# Altium schematic sheet Sheet6.SchDoc
size B
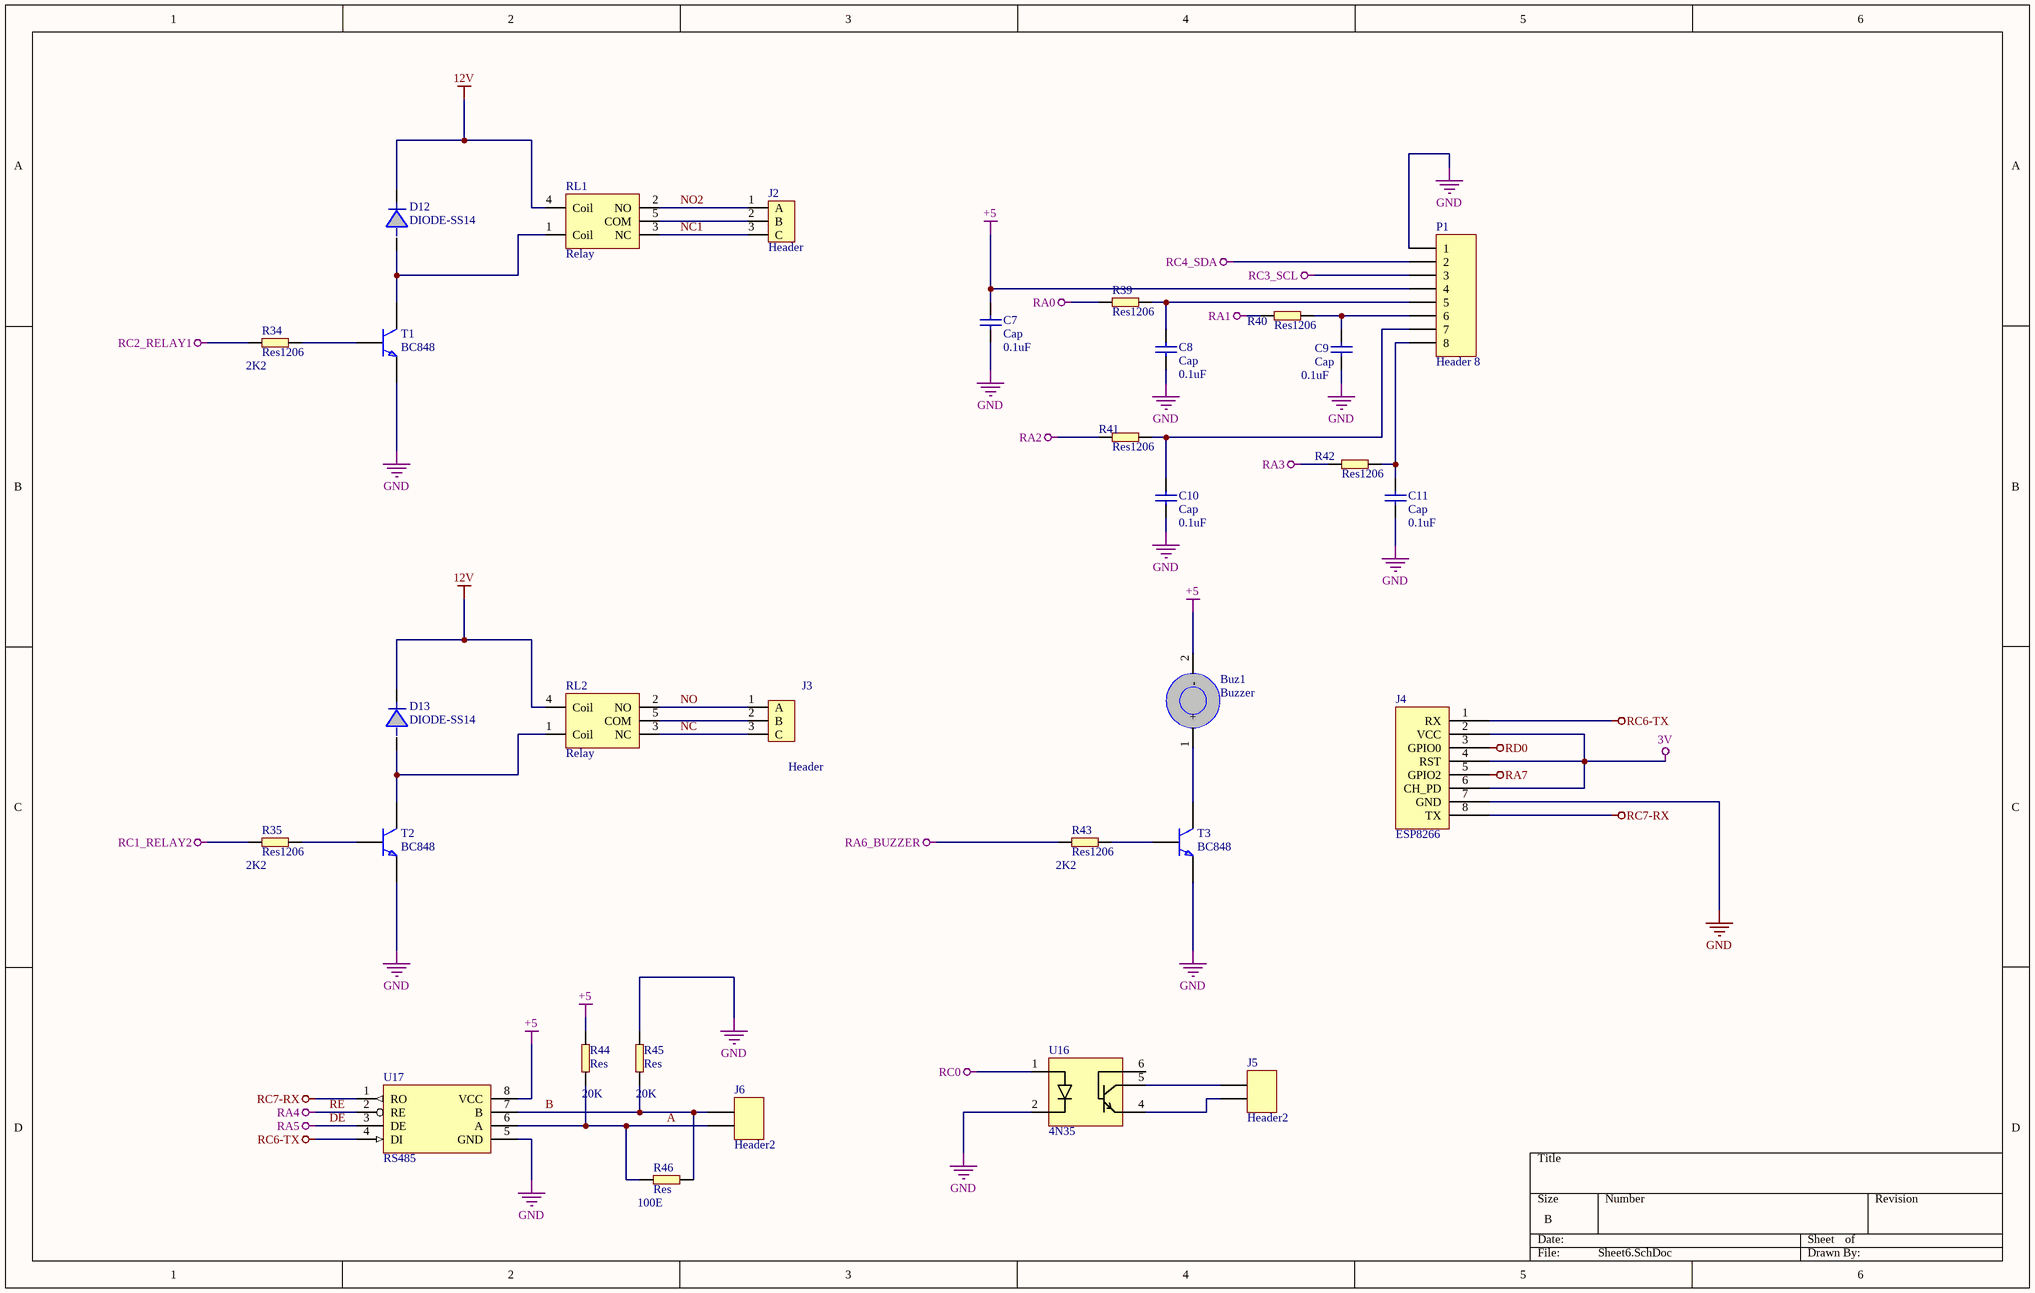
[diagram p0: Sheet6.SchDoc]

## Parts
Buz1  Buzzer  [Buzzer]
C7  Cap  [1206]
C8  Cap  [RES0805]
C9  Cap  [RES0805]
C10  Cap  [RES0805]
C11  Cap  [RES0805]
D12  DIODE-SS14  [DO-214AC]
D13  DIODE-SS14  [DO-214AC]
J2  Header  [HEADER AC SMALL]
J3  Header  [HEADER AC SMALL]
J4  ESP8266  [ESP8266]
J5  Header2  [Header2]
J6  Header2  [Header2]
P1  Header 8  [HDR1X8]
R34  Res1206  value 2K2  [1206]
R35  Res1206  value 2K2  [1206]
R39  Res1206  [1206]
R40  Res1206  [1206]
R41  Res1206  [1206]
R42  Res1206  [1206]
R43  Res1206  value 2K2  [1206]
R44  Res  value 20K  [RES0805]
R45  Res  value 20K  [RES0805]
R46  Res  value 100E  [RES0805]
RL1  Relay  [Relay]
RL2  Relay  [Relay]
T1  BC848  [SOT23]
T2  BC848  [SOT23]
T3  BC848  [SOT23]
U16  4N35  [4N35]
U17  RS485  [RS485]

## Nets
3V: J4.2(VCC) J4.4(RST) J4.6(CH_PD)
12V: D12.2(B) D13.2(B) RL1.4(Coil) RL2.4(Coil)
+5: Buz1.2(-) C7.2(A) P1.4 R44.2(b) U17.8(VCC)
DE: U17.3(DE)  [also labelled RA5]
GND: C7.1(A) C8.1(A) C9.1(A) C10.1(A) C11.1(A) J4.7(GND) P1.1 R45.2(b) T1.2(E) T2.2(E) T3.2(E) U16.2(B) U17.5(GND)
RA0: R39.2(b)
RA1: R40.2(b)
RA2: R41.2(b)
RA3: R42.2(b)
RA6_BUZZER: R43.2(b)
RA7: J4.5(GPIO2)
RC0: U16.1(A)
RC1_RELAY2: R35.1(a)
RC2_RELAY1: R34.1(a)
RC3_SCL: P1.3
RC4_SDA: P1.2
RC6-TX: J4.1(RX) U17.4(DI)
RC7-RX: J4.8(TX) U17.1(RO)
RD0: J4.3(GPIO0)
RE: U17.2(RE)  [also labelled RA4]
A: J6.2 R44.1(a) R46.1(a) U17.6(A)
B: J6.1 R45.1(a) R46.2(b) U17.7(B)
NC: J3.3(C) RL2.3(NC)
NC1: J2.3(C) RL1.3(NC)
NO: J3.1(A) RL2.2(NO)
NO2: J2.1(A) RL1.2(NO)
NetBuz1_1: Buz1.1(+) T3.3(C)
NetC8_2: C8.2(A) P1.5 R39.1(a)
NetC9_2: C9.2(A) P1.6 R40.1(a)
NetC10_2: C10.2(A) P1.7 R41.1(a)
NetC11_2: C11.2(A) P1.8 R42.1(a)
NetD12_1: D12.1(A) RL1.1(Coil) T1.3(C)
NetD13_1: D13.1(A) RL2.1(Coil) T2.3(C)
NetJ2_2: J2.2(B) RL1.5(COM)
NetJ3_2: J3.2(B) RL2.5(COM)
NetJ5_1: J5.1 U16.5(E)
NetJ5_2: J5.2 U16.4(D)
NetR34_2: R34.2(b) T1.1(B)
NetR35_2: R35.2(b) T2.1(B)
NetR43_1: R43.1(a) T3.1(B)

Not connected (* = marked no-connect by the designer): U16 6(F)

## Notes on the sheet
- (in symbol CAP_104_SMD) 0.1uF

## Library data of the parts
C7-C11 = CAP_104_SMD
D12 D13 = DIODE-SS14: SS14
J2 J3 = HEADER AC SMALL
J4 = ESP8266: WIFI Module
P1 = Header 8: Header, 8-Pin; LatestRevisionDate: 17-Jul-2002; LatestRevisionNote: Re-released for DXP Platform.; Publisher: Altium Limited
R44-R46 = Resistor: Res0805
RL1 RL2 = Relay: Relay 12V
T1-T3 = BC848: TRANSISTOR
U16 = 4N35: Optocoupler
U17 = RS485: 8-Pin SO